# Altium schematic sheet Main_Power_Supply.SchDoc
size A4; SheetNumber: 2; SheetTotal: 3
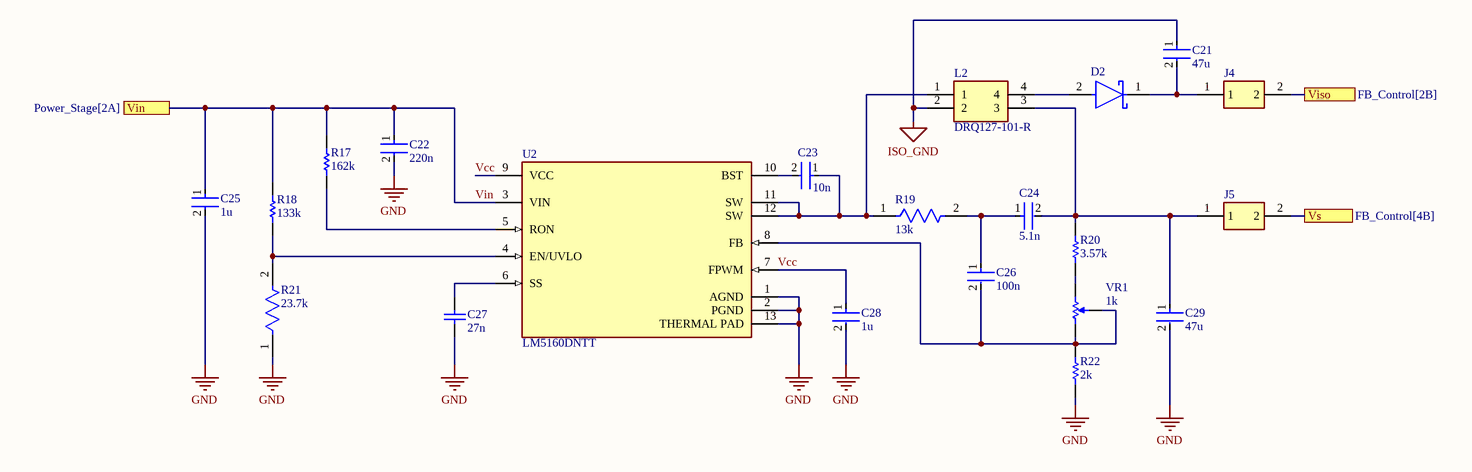
[diagram p0: Main_Power_Supply.SchDoc]

## Parts
C21  47u  [FP-GRM32E-0_3-0_2-IPC_A]
C22  220n  [FP-GRM21A-0_1-MFG]
C23  10n  [FP-0805-L_2_01_0_2-W_1_25-IPC_B]
C24  5.1n  [FP-GRM219-0_1-IPC_A]
C25  1u  [FP-1210-L_3_3_0_4-W_2_5_0-IPC_C]
C26  100n  [FP-0805-L_2_01_0_2-W_1_25-MFG]
C27  27n  [CAPC1005X56X25LL10T15]
C28  1u  [FP-1210-L_3_3_0_4-W_2_5_0-IPC_C]
C29  47u  [FP-GRM32E-0_3-0_2-IPC_A]
D2  MBR230LSFT1G  [FP-498-MFG]  (value not drawn)
J4  22-28-4020  [MOLEX_22-28-4020]  (value not drawn)
J5  22-28-4020  [MOLEX_22-28-4020]  (value not drawn)
L2  DRQ127-101-R  [DRQ127101R]
R17  162k  [RESC1608X55X30ML15T15]
R18  133k  [RESC1608X55X30LL15T15]
R19  13k  [FP-ERJ3EK-IPC_C]
R20  3.57k  [RESC1608X55X30LL15T15]
R21  23.7k  [FP-ERJ3EK-IPC_C]
R22  2k  [RESC1608X55X30ML15T15]
U2  LM5160DNTT  [FP-DNT0012B-MFG]
VR1  1k  [BOUR-3296W-1-3]

## Ports
Vin (see Power_Stage[2A]), Viso (see FB_Control[2B]), Vs (see FB_Control[4B])

## Nets
GND: C22.2 C25.2 C27.1 C28.2 C29.2 R21.1 R22.1 U2.1(AGND) U2.2(PGND) U2.13(THERMAL_PAD)
ISO_GND: C21.1 L2.2
Vcc: C28.1 U2.7(FPWM) U2.9(VCC)
Vin: C22.1 C25.1 R17.2 R18.2 U2.3(VIN) ; port Vin
Viso: J4.2 ; port Viso
Vs: J5.2 ; port Vs
NetC21_2: C21.2 D2.1(C) J4.1
NetC23_1: C23.1 L2.1 R19.1 U2.11(SW) U2.12(SW)
NetC23_2: C23.2 U2.10(BST)
NetC24_1: C24.1 C26.1 R19.2
NetC24_2: C24.2 C29.1 J5.1 L2.3 R20.2
NetC26_2: C26.2 R22.2 U2.8(FB) VR1.1(A) VR1.3(TAP)
NetC27_2: C27.2 U2.6(SS)
NetD2_2: D2.2(A) L2.4
NetR17_1: R17.1 U2.5(RON)
NetR18_1: R18.1 R21.2 U2.4(EN/UVLO)
NetR20_1: R20.1 VR1.2(B)

## Library data of the parts
C21 C29 = CMP-06035-017875-1: Chip Multilayer Ceramic Capacitors for General Purpose, 1210, 47uF, X6S, 22%, 10%, 16V; Thickness: 2.5mm; Capacitance: 47uF; Length: 3.2mm; Dielectric: X6S; Width: 2.5mm; Case/Package: 1210; Tolerance: 10%; Voltage Rating (DC): 16V
C22 = CMP-1036-04561-4: CAP CER 0.22UF 100V X7R 0805; Material: Ceramic; Tolerance: 10%; Capacitance: 220nF; Radiation Hardening: No; Case Code (Imperial): 0805; Height: 1mm; Length: 2mm; Case/Package: 0805; Packaging: Tape and Reel; Case Code (Metric): 2012; Thickness: 0.039inch; Voltage Rating (DC): 100V; Width: 1.25mm; Max Operating Temperature: 125°C; Voltage: 100V; Dielectric: X7R; Mount: Surface Mount; Package Quantity: 3000; Voltage Rating: 100V; REACH SVHC: No SVHC; Depth: 1.25mm; Min Operating Temperature: -55°C; Termination: SMD/SMT; Lead Free: Lead Free
C23 = CMP-2007-04361-2: General Purpose Ceramic Capacitor, 0805, 10nF, 5%, X7R, 0.15, 50V; Insulation Resistance: 100GR; Dissipation Factor: 2.5%; Series: -; Case Code (Imperial): 0805; Voltage Rating (DC): 50V; Dielectric: X7R; Voltage Rating: 50V; Lead Free: Lead Free; Max Operating Temperature: 125°C; Depth: 1.25mm; Termination: SMD/SMT; Number of Pins: 2; Dielectric Material: Ceramic; Capacitance: 10nF; Case/Package: 0805; Contact Plating: Tin; Mount: Surface Mount; Height: 0.71mm; Package Quantity: 1; Packaging: Tape and Reel; Construction: Flat; RoHS Compliant: Yes; Voltage: 50V; Case Code (Metric): 2012; REACH SVHC: No SVHC; Tolerance: 5%; Radiation Hardening: No; Width: 0.049inch; Thickness: 0.037inch; Length: 2.01mm; Min Operating Temperature: -55°C
C24 = CMP-2007-00142-2: Chip Multilayer Ceramic Capacitors for General Purpose, 0805, 5100pF, C0G, 30ppm/°C, 5%, 50V; Capacitance: 5.1nF; Min Operating Temperature: -55°C; Voltage Rating (DC): 50V; Radiation Hardening: No; Case/Package: 0805; Depth: 1.25mm; Case Code (Imperial): 0805; Voltage: 50V; Lead Free: Lead Free; Mount: Surface Mount; Packaging: Tape and Reel; Width: 0.049inch; Height: 0.85mm; Length: 2mm; Voltage Rating: 50V; Thickness: 0.037inch; Package Quantity: 1; Tolerance: 5%; Max Operating Temperature: 125°C; Case Code (Metric): 2012; Termination: SMD/SMT; Dielectric: C0G
C25 C28 = CMP-2000-05475-2: General Purpose Ceramic Capacitor, 1210, 1uF, 10%, X7R, 15%, 100V; Tolerance: 20%; Dissipation Factor: 2.5%; Voltage Rating (DC): 100V; Series: -; Voltage Rating: 100V; Max Operating Temperature: 125°C; Radiation Hardening: No; Length: 3.2mm; Mount: Surface Mount; Termination: SMD/SMT; Voltage: 100V; RoHS Compliant: Yes; Case/Package: 1210; Thickness: 0.11inch; REACH SVHC: No SVHC; Lead Free: Lead Free; Height: 2.79mm; Case Code (Imperial): 1210; Contact Plating: Tin; Case Code (Metric): 3225; Min Operating Temperature: -55°C; Construction: Flat; Capacitance: 1uF; Depth: 2.5mm; Dielectric: X7R; Package Quantity: 1; Packaging: Tape and Reel; Width: 2.5mm
C26 = CMP-2000-05808-2: General Purpose Ceramic Capacitor, 0805, 100nF, 5%, X7R, 0.15, 50V; Dissipation Factor: 2.5%; Insulation Resistance: 100GR; Length: 2.01mm; Min Operating Temperature: -55°C; Number of Pins: 2; Width: 0.049inch; Height: 0.94mm; Max Operating Temperature: 125°C; RoHS Compliant: Yes; Depth: 1.25mm; Radiation Hardening: No; Case Code (Metric): 2012; Case/Package: 0805; Contact Plating: Tin; Mount: Surface Mount; Tolerance: 5%; Dielectric Material: Ceramic; Case Code (Imperial): 0805; Capacitance: 100nF; Dielectric: X7R; Voltage Rating: 50V; REACH SVHC: No SVHC; Thickness: 0.037inch; Voltage Rating (DC): 50V; Lead Free: Lead Free; Package Quantity: 1; Packaging: Tape and Reel; Voltage: 50V; Termination: SMD/SMT
C27 = CMP-2008-02846-1: Part Number: 0402YD273KAT2A; Manufacturer: AVX Interconnect / Elco
D2 = CMP-1055-00442-2: DIODE SCHOTTKY 30V 2A SOD123L; Max Forward Surge Current (Ifsm): 40A; Element Configuration: Single; Forward Voltage: 430mV; Peak Reverse Current: 1mA; Max Reverse Voltage (DC): 30V; Max Operating Temperature: 125°C; Max Repetitive Reverse Voltage (Vrrm): 30V; Forward Current: 2A; Package Quantity: 1; Height: 0.9mm; REACH SVHC: No SVHC; Contact Plating: Tin; Min Operating Temperature: -55°C; Lead Free: Lead Free; Average Rectified Current: 2A; Halogen Free: Halogen Free; Peak Non-Repetitive Surge Current: 40A; Radiation Hardening: No; Case/Package: SOD; Number of Pins: 2; Packaging: Tape and Reel; Width: 1.8mm; Length: 2.9mm
J4 J5 = 22-28-4020: Connector Header Through Hole 2 position 0.100 (2.54mm); MF: Molex; MP: 22-28-4020; Purchase-URL: https://pricing.snapeda.com/search/part/22-28-4020/?ref=eda; Availability: In Stock; SnapEDA_Link: https://www.snapeda.com/parts/22-28-4020/Molex/view-part/?ref=snap; Package: None; Check_prices: https://www.snapeda.com/parts/22-28-4020/Molex/view-part/?ref=eda; Value: *; Price: None
L2 = DRQ127-101-R: Inductor; Manufacturer_Name: Eaton; Datasheet Link: https://www.eaton.com/content/dam/eaton/products/electronic-components/resources/data-sheet/eaton-drq-shielded-drum-core-power-inductors-data-sheet.pdf; Height: 8mm; Manufacturer_Part_Number: DRQ127-101-R; Mouser Part Number: 704-DRQ127-101-R; Mouser Price/Stock: https://www.mouser.co.uk/ProductDetail/Coiltronics-Eaton/DRQ127-101-R?qs=yzwxPInThYRNK3mQinvZTQ%3D%3D; Arrow Part Number: DRQ127-101-R; Arrow Price/Stock: https://www.arrow.com/en/products/drq127-101-r/eaton
R17 = CMP-1012-00758-2: Manufacturer: Panasonic; Part Number: ERJ-3EKF1623V
R18 = CMP-2000-00239-1: Manufacturer: Panasonic; Part Number: ERJ-3EKF1333V
R19 = CMP-2000-00233-2: RES SMD 13K OHM 1% 1/10W 0603; Voltage Rating (DC): 50V; Max Power Dissipation: 100mW; Voltage Rating: 75V; Resistance: 13kR; Temperature Coefficient: 100ppm/°C; REACH SVHC: No SVHC; Contact Plating: Tin; Case/Package: 0603; Length: 1.6mm; Case Code (Metric): 1608; Construction: Rectangular; Case Code (Imperial): 0603; Termination: SMD/SMT; Power Rating: 100mW; Weight: 7.1E-05oz; Package Quantity: 1; Packaging: Tape and Reel; Mount: Surface Mount; Resistance Tolerance: 1%; Width: 0.031inch; Tolerance: 1%; Max Operating Temperature: 155°C; Features: Automotive AEC-Q200; Height: 0.45mm; Number of Terminations: 2; Series: ERJ; Military Standard: Not; Resistor Type: Thick Film; Min Operating Temperature: -55°C; Lead Free: Lead Free; Depth: 0.8mm; Technology: THICK FILM; RoHS Compliant: Yes; Radiation Hardening: No
R20 = CMP-1012-00571-2: Part Number: ERJ-3EKF3571V; Manufacturer: Panasonic
R21 = CMP-2000-00357-6: RES SMD 23.7K OHM 1% 1/10W 0603; Voltage Rating: 75V; Power Rating: 100mW; Temperature Coefficient: 100ppm/°C; Voltage Rating (DC): 50V; Resistance: 23.7kR; Packaging: Tape and Reel; Width: 0.8mm; Height: 0.022inch; Construction: Rectangular; Contact Plating: Tin; Mount: Surface Mount; Max Operating Temperature: 155°C; Case/Package: 0603; Termination: SMD/SMT; Depth: 0.8mm; Tolerance: 1%; Weight: 7.1E-05oz; Military Standard: Not; RoHS Compliant: Yes; Min Operating Temperature: -55°C; Series: ERJ; Max Power Dissipation: 100mW; Length: 0.063inch; Case Code (Imperial): 0603; Resistance Tolerance: 1%; Number of Terminations: 2; Resistor Type: Thick Film; Package Quantity: 5000; Case Code (Metric): 1608; Lead Free: Lead Free; Radiation Hardening: No; Features: Automotive AEC-Q200
R22 = CMP-2000-00317-1: Part Number: ERJ-3EKF2001V; Manufacturer: Panasonic
U2 = CMP-04918-000448-1: IC REG BCK FLYBCK ADJ 12WSON; Min Input Voltage: 4.5V; Operating Supply Current: 2.3mA; Output Current: 1.5A; Number of Outputs: 1; Topology: Flyback; Synchronous Rectifier: Yes; Output Type: Adjustable; Max Input Voltage: 65V; Min Output Voltage: 2V; Switching Frequency: 1MHz; Output Voltage: 60V; Mount: Surface Mount; Min Operating Temperature: -40°C; Package Quantity: 250; Min Supply Voltage: 4.5V; Max Operating Temperature: 125°C; RoHS Compliant: Yes; Contact Plating: Tin; Height: 0.8mm; Packaging: Tape and Reel; Quiescent Current: 2.3mA; Lead Free: Lead Free; Number of Pins: 12; Max Output Current: 1.5A; REACH SVHC: No SVHC; Width: 4mm; Operating Supply Voltage: 65V; Max Output Voltage: 60V; Length: 4mm
VR1 = CMP-1747-00002-1: Square Trimpot(R) Trimming Potentiometer, 1000 Ohm, -55 to 125 degC, 3-Pin THD, RoHS, Tube; Case\Package: 0603; Tolerance: 1%; Power Rating: 100 mW; Voltage Rating: 75 V; Resistance: 4.7 kohm; ComponentLink2URL: http://www.bourns.com/docs/Product-Datasheets/3296.pdf; Packaging: Tape and Reel; REACH SVHC: Yes; ComponentLink1URL: http://www.bourns.com/; Case Code (Metric): 1608; Width: 0.8 mm; ComponentLink1Description: Manufacturer URL; DatasheetVersion: May-16; Max Operating Temperature: 155 degC; PackageReference: 3296W-1-3; PackageDescription: 3-Pin Through Hole Device, Body 9.53 x 4.83 mm, Pitch 2.54 mm; Weight: 7.1E-05 oz; ComponentLink2Description: Datasheet; RoHSCompliant: true; Min Operating Temperature: -55 degC; Radiation Hardening: No; Case Code (Imperial): 0603; Length: 1.6 mm; Package Quantity: 5000; Pins: 2; Mount: Surface Mount; Height: 0.45 mm